# EAGLE design XPDR_Board_2 (EAGLE 7.2.0)
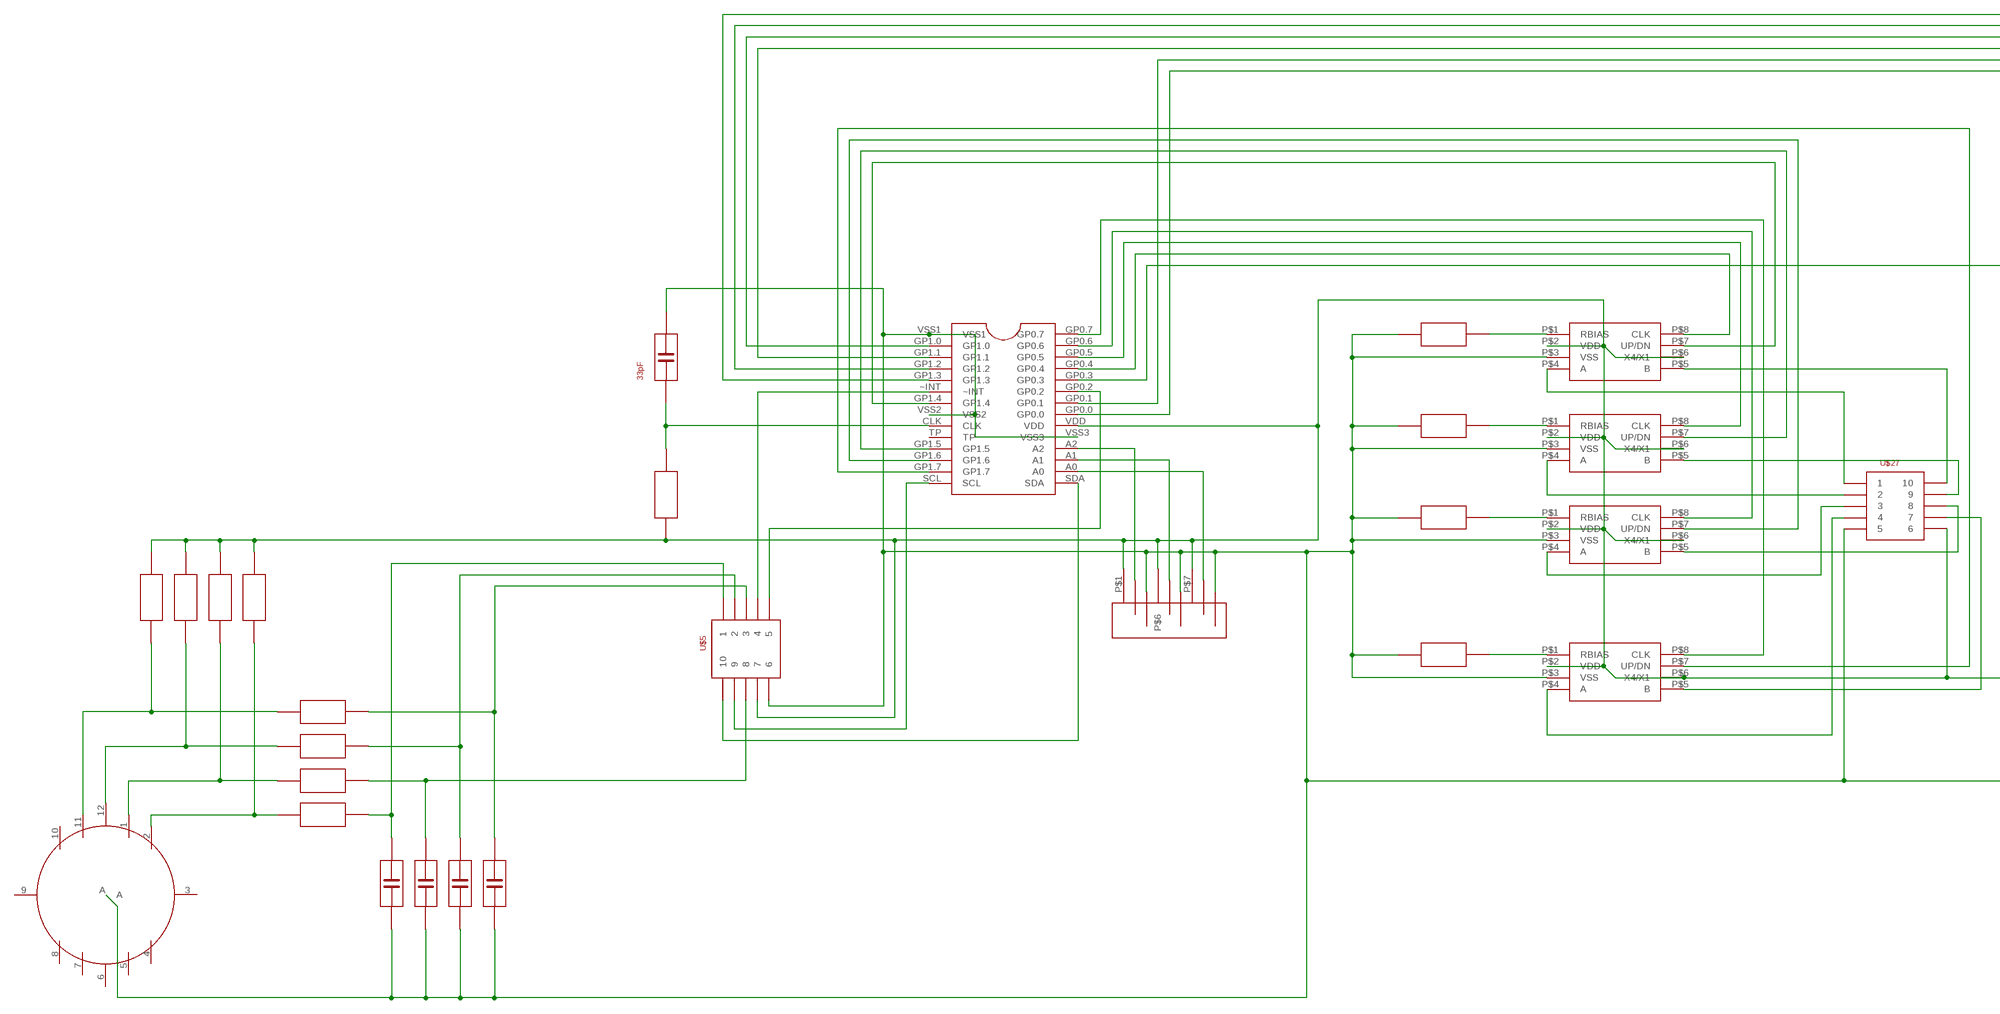
[diagram p0: schematic, sheet 1, part 1 of 2]
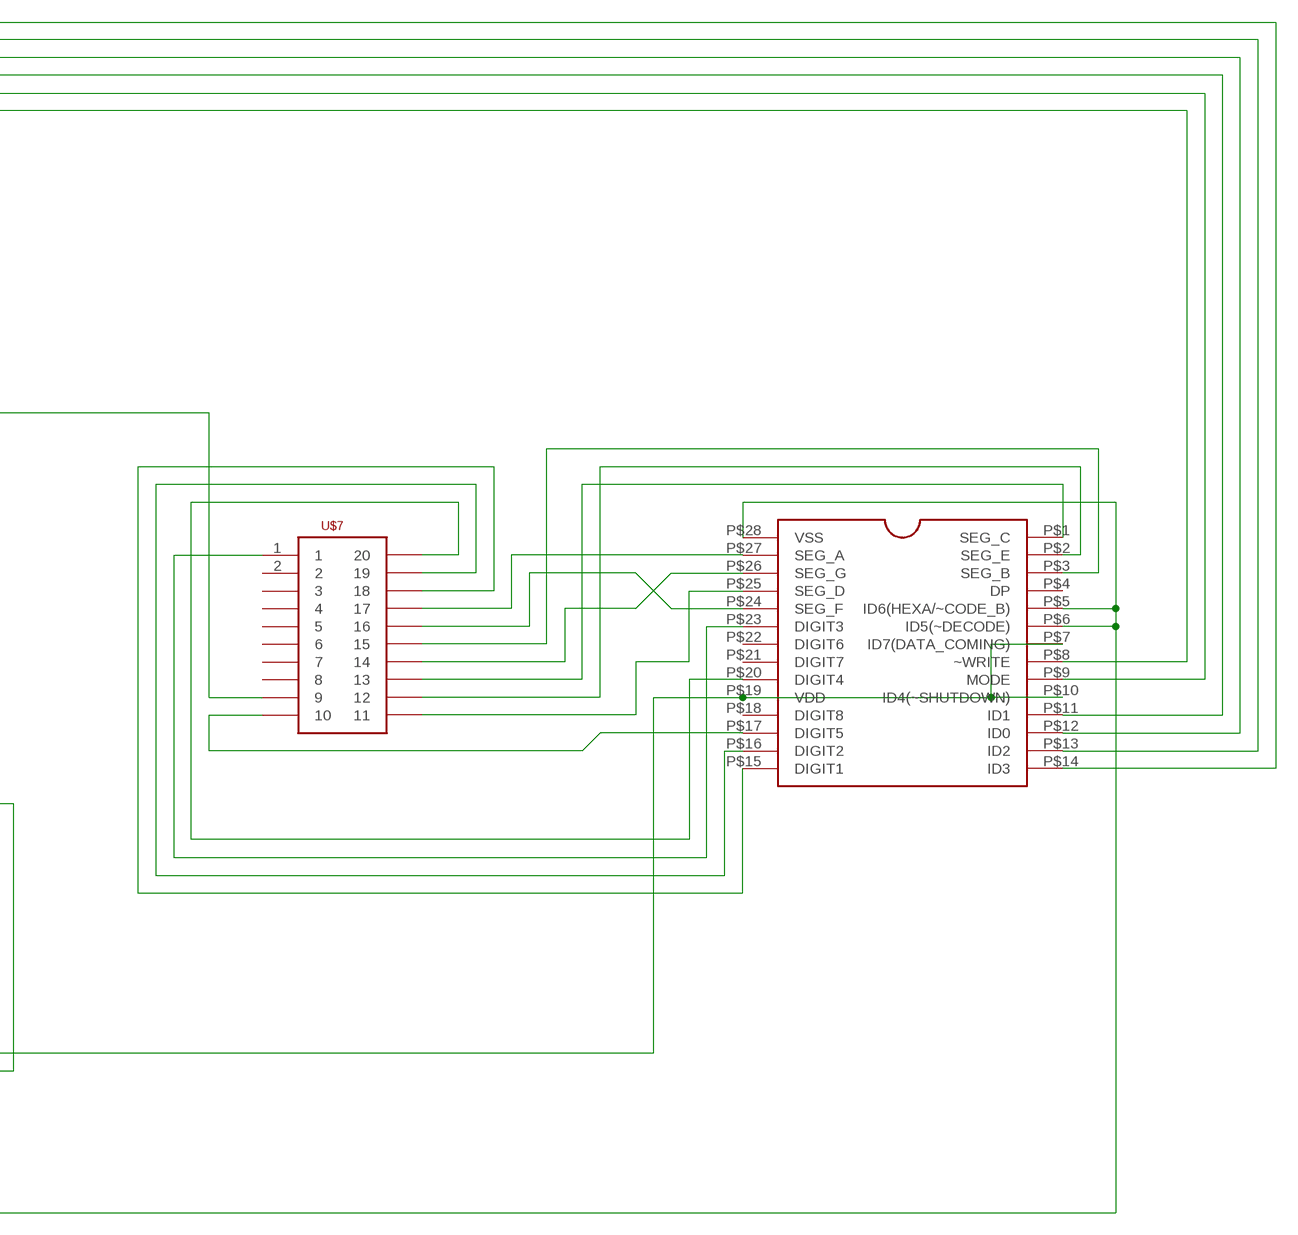
[diagram p1: schematic, sheet 1, part 2 of 2]

## Parts
U$1  LS7084  [LS7084]
U$2  LS7084  [LS7084]
U$3  LS7084  [LS7084]
U$4  LS7084  [LS7084]
U$5  LISTA_2X5  [LISTA_2X5]
U$6  ICM7228A  [ICM7228A]
U$7  LISTA_2X10  [LISTA_2X10]
U$8  470M  REZISTOR  [REZISTOR]
U$9  MCP23016  [MCP23016]
U$10  470M  REZISTOR  [REZISTOR]
U$11  ADRESA_0..2  [ADRESA_0..2]
U$12  470M  REZISTOR  [REZISTOR]
U$13  470M  REZISTOR  [REZISTOR]
U$14  3.9k  REZISTOR  [REZISTOR]
U$15  33pF  KONDENZATOR  [KONDENZATOR]
U$16  ROTARY_SWITCH  [ROTARY_SWITCH]
U$17  REZISTOR  [REZISTOR]
U$18  REZISTOR  [REZISTOR]
U$19  REZISTOR  [REZISTOR]
U$20  REZISTOR  [REZISTOR]
U$21  REZISTOR  [REZISTOR]
U$22  REZISTOR  [REZISTOR]
U$23  REZISTOR  [REZISTOR]
U$24  REZISTOR  [REZISTOR]
U$25  KONDENZATOR  [KONDENZATOR]
U$26  KONDENZATOR  [KONDENZATOR]
U$27  LISTA_2X5  [LISTA_2X5]
U$28  KONDENZATOR  [KONDENZATOR]
U$29  KONDENZATOR  [KONDENZATOR]

## Nets
GND: U$1.P$3(VSS) U$2.P$3(VSS) U$3.P$3(VSS) U$4.P$3(VSS) U$5.6 U$6.P$5(ID6(HEXA/~CODE_B)) U$6.P$6(ID5(~DECODE)) U$6.P$28(VSS) U$8.P$1 U$9.VSS1 U$9.VSS2 U$9.VSS3 U$10.P$1 U$11.P$3 U$11.P$4 U$11.P$9 U$12.P$1 U$13.P$1 U$15.P$2 U$16.A U$25.P$1 U$26.P$1 U$27.5 U$28.P$1 U$29.P$1
N$1: U$6.P$27(SEG_A) U$7.17
N$2: U$6.P$24(SEG_F) U$7.16
N$3: U$6.P$3(SEG_B) U$7.15
N$4: U$6.P$26(SEG_G) U$7.14
N$5: U$6.P$1(SEG_C) U$7.13
N$6: U$6.P$2(SEG_E) U$7.12
N$7: U$6.P$25(SEG_D) U$7.11
N$8: U$6.P$15(DIGIT1) U$7.18
N$9: U$6.P$16(DIGIT2) U$7.19
N$10: U$6.P$23(DIGIT3) U$7.1
N$11: U$6.P$20(DIGIT4) U$7.20
N$12: U$1.P$2(VDD) U$1.P$6(X4/X1) U$2.P$2(VDD) U$2.P$6(X4/X1) U$3.P$2(VDD) U$3.P$6(X4/X1) U$4.P$2(VDD) U$4.P$6(X4/X1) U$5.7 U$6.P$7(ID7(DATA_COMING)) U$6.P$10(ID4(~SHUTDOWN)) U$6.P$19(VDD) U$9.VDD U$11.P$1 U$11.P$6 U$11.P$7 U$14.P$1 U$17.P$1 U$18.P$1 U$19.P$1 U$20.P$1 U$27.6
N$13: U$6.P$12(ID0) U$9.GP1.0
N$14: U$1.P$8(CLK) U$9.GP0.4
N$15: U$2.P$8(CLK) U$9.GP0.5
N$16: U$1.P$1(RBIAS) U$8.P$2
N$17: U$2.P$1(RBIAS) U$10.P$2
N$18: U$3.P$1(RBIAS) U$12.P$2
N$19: U$4.P$1(RBIAS) U$13.P$2
N$20: U$6.P$11(ID1) U$9.GP1.1
N$21: U$3.P$8(CLK) U$9.GP0.6
N$22: U$4.P$8(CLK) U$9.GP0.7
N$23: U$1.P$7(UP/DN) U$9.GP1.4
N$24: U$1.P$4(A) U$27.1
N$25: U$1.P$5(B) U$27.10
N$26: U$2.P$4(A) U$27.2
N$27: U$2.P$5(B) U$27.9
N$28: U$3.P$4(A) U$27.3
N$29: U$3.P$5(B) U$27.8
N$30: U$4.P$4(A) U$27.4
N$31: U$4.P$5(B) U$27.7
N$32: U$2.P$7(UP/DN) U$9.GP1.5
N$33: U$3.P$7(UP/DN) U$9.GP1.6
N$34: U$4.P$7(UP/DN) U$9.GP1.7
N$35: U$9.A0 U$11.P$8
N$36: U$9.A1 U$11.P$5
N$37: U$9.A2 U$11.P$2
N$38: U$6.P$13(ID2) U$9.GP1.2
N$39: U$6.P$14(ID3) U$9.GP1.3
N$40: U$16.11 U$17.P$2 U$21.P$2
N$41: U$6.P$8(~WRITE) U$9.GP0.0
N$42: U$6.P$9(MODE) U$9.GP0.1
N$43: U$16.12 U$18.P$2 U$22.P$2
N$44: U$5.9 U$9.SCL
N$45: U$5.10 U$9.SDA
N$46: U$5.4 U$9.~INT
N$47: U$5.5 U$9.GP0.2
N$48: U$9.CLK U$14.P$2 U$15.P$1
N$49: U$7.9 U$9.GP0.3
N$50: U$6.P$17(DIGIT5) U$7.10
N$51: U$16.1 U$19.P$2 U$23.P$2
N$52: U$16.2 U$20.P$2 U$24.P$2
N$54: U$5.8 U$23.P$1 U$26.P$2
N$55: U$5.2 U$22.P$1 U$28.P$2
N$56: U$5.3 U$21.P$1 U$29.P$2
N$59: U$5.1 U$24.P$1 U$25.P$2
Unconnected: U$6.P$4(DP) U$6.P$18(DIGIT8) U$6.P$21(DIGIT7) U$6.P$22(DIGIT6) U$7.2 U$7.3 U$7.4 U$7.5 U$7.6 U$7.7 U$7.8 U$9.TP U$16.3 U$16.4 U$16.5 U$16.6 U$16.7 U$16.8 U$16.9 U$16.10

## Library data of the parts
U$1-U$4 = library:LS7084
U$5 U$27 = library:LISTA_2X5
U$6 = library:ICM7228A
U$7 = library:LISTA_2X10
U$8 U$10 U$12-U$14 U$17-U$24 = library:REZISTOR
U$9 = library:MCP23016
U$11 = library:ADRESA_0..2
U$15 U$25 U$26 U$28 U$29 = library:KONDENZATOR
U$16 = library:ROTARY_SWITCH

## Board
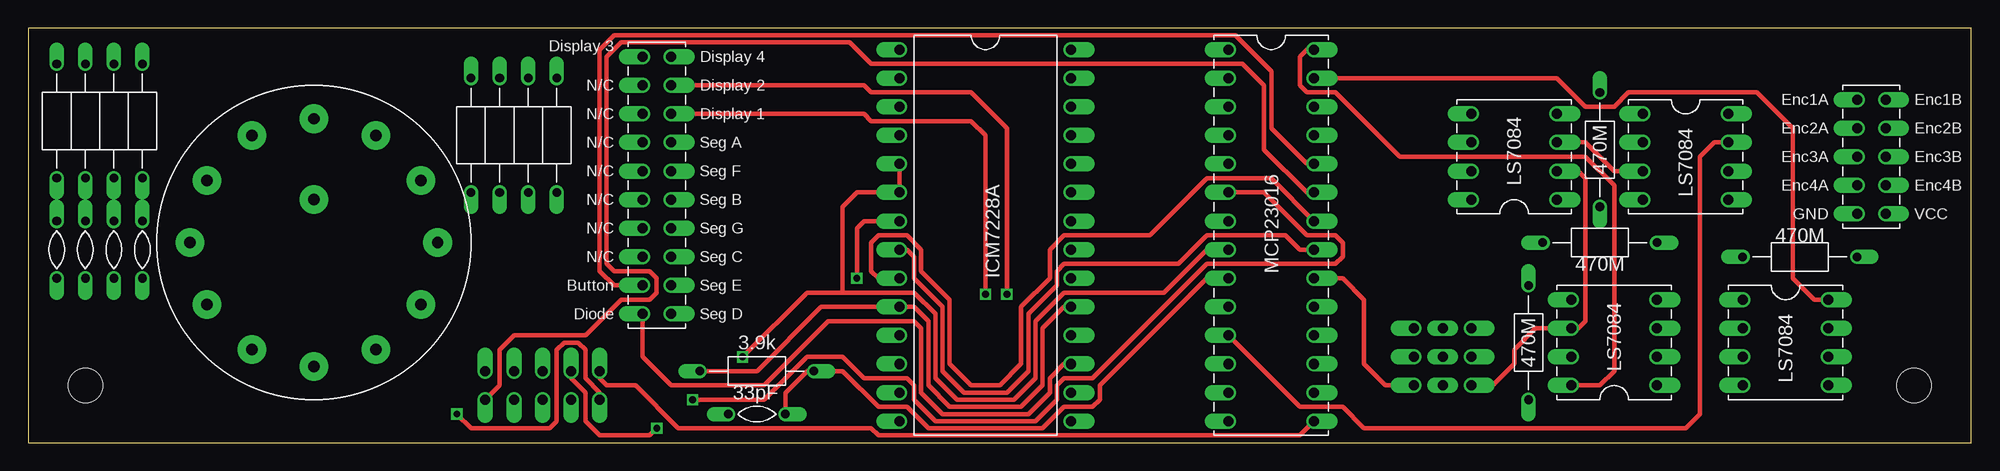
[diagram p2: board, top side]
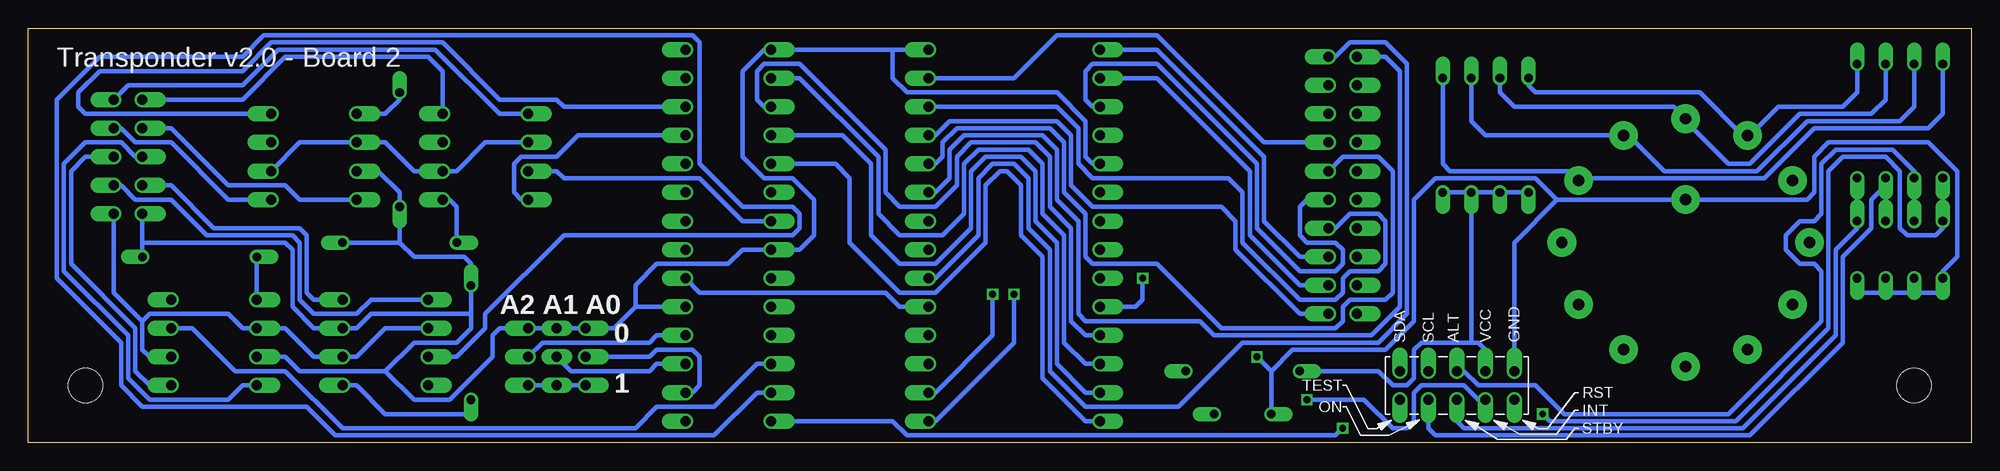
[diagram p3: board, bottom side, seen from below]

Size 172.72 x 36.83 mm. Coordinates in mm from the lower left corner, seen from the top.
Outline: 0,36.83 0,0 172.72,0 172.72,36.83 0,36.83
Copper layers (1*16): Top 0.035mm / dielectric 1.5mm / Bottom 0.035mm
Design rules "RadioStack_v2 *": minimum track width 0.2mm, minimum drill 0.4mm, track to track 0.2mm, track to pad 0.2mm, pad to pad 0.2mm, via to via 0.2mm, smd to smd 0.2mm, copper to edge 0.4mm, drill to drill 8mil, minimum pad ring 10mil, minimum via ring 8mil, stop-mask expansion 4mil, vias tented up to drill 0mil, thermal gap 10mil
Holes 3.05 mm at 167.64,5.08 5.08,5.08

### Footprints (pad centres in the part's own frame; a part is rotated, then mirrored left to right if it is on the bottom)
LS7084 = drill 0.889 pad 1.27 offset: P$1 0,0; P$2 0,-2.54; P$3 0,-5.08; P$4 0,-7.62; P$5 7.62,-7.62; P$6 7.62,-5.08; P$7 7.62,-2.54; P$8 7.62,0
LISTA_2X5 = drill 0.889 pad 1.27 offset: 1 0,0; 2 0,-2.54; 3 0,-5.08; 4 0,-7.62; 5 0,-10.16; 6 2.54,-10.16; 7 2.54,-7.62; 8 2.54,-5.08; 9 2.54,-2.54; 10 2.54,0
ICM7228A = drill 0.889 pad 1.27 offset: P$1 0,0; P$2 0,-2.54 | drill 0.889 offset: P$3 0,-5.08; P$4 0,-7.62; P$5 0,-10.16; P$6 0,-12.7; P$7 0,-15.24; P$8 0,-17.78; P$9 0,-20.32; P$10 0,-22.86; P$11 0,-25.4; P$12 0,-27.94; P$13 0,-30.48; P$14 0,-33.02; P$15 15.24,-33.02; P$16 15.24,-30.48; P$17 15.24,-27.94; P$18 15.24,-25.4; P$19 15.24,-22.86; P$20 15.24,-20.32; P$21 15.24,-17.78; P$22 15.24,-15.24; P$23 15.24,-12.7; P$24 15.24,-10.16; P$25 15.24,-7.62; P$26 15.24,-5.08; P$27 15.24,-2.54; P$28 15.24,0
LISTA_2X10 = drill 0.889 pad 1.27 offset: 1 0,0; 2 0,-2.54; 3 0,-5.08; 4 0,-7.62; 5 0,-10.16; 6 0,-12.7; 7 0,-15.24; 8 0,-17.78; 9 0,-20.32; 10 0,-22.86; 11 2.54,-22.86; 12 2.54,-20.32; 13 2.54,-17.78; 14 2.54,-15.24; 15 2.54,-12.7; 16 2.54,-10.16; 17 2.54,-7.62; 18 2.54,-5.08; 19 2.54,-2.54; 20 2.54,0
REZISTOR = drill 0.762 pad 1.27 offset: P$1 -5.08,0; P$2 5.08,0
MCP23016 = drill 0.889 pad 1.27 offset: A0 7.62,-30.48; A1 7.62,-27.94; A2 7.62,-25.4; CLK 0,-20.32; GP0.0 7.62,-17.78; GP0.1 7.62,-15.24; GP0.2 7.62,-12.7; GP0.3 7.62,-10.16; GP0.4 7.62,-7.62; GP0.5 7.62,-5.08; GP0.6 7.62,-2.54; GP0.7 7.62,0; GP1.0 0,-2.54; GP1.1 0,-5.08; GP1.2 0,-7.62; GP1.3 0,-10.16; GP1.4 0,-15.24; GP1.5 0,-25.4; GP1.6 0,-27.94; GP1.7 0,-30.48; SCL 0,-33.02; SDA 7.62,-33.02; TP 0,-22.86; VDD 7.62,-20.32; VSS1 0,0; VSS2 0,-17.78; VSS3 7.62,-22.86; ~INT 0,-12.7
ADRESA_0..2 = drill 0.889 pad 1.27 offset: P$1 0,0; P$2 0,-2.54; P$3 0,-5.08; P$7 5.08,0; P$8 5.08,-2.54; P$9 5.08,-5.08 | drill 0.889 pad 1.27 long: P$4 2.54,-5.08; P$5 2.54,-2.54; P$6 2.54,0
KONDENZATOR = drill 0.762 pad 1.27 offset: P$1 -2.54,0; P$2 2.54,0
ROTARY_SWITCH = drill 1.016 pad 2.54: 1 5.5,9.5; 2 9.5,5.5; 3 11,0; 4 9.5,-5.5; 5 5.5,-9.5; 6 0,-11; 7 -5.5,-9.5; 8 -9.5,-5.5; 9 -11,0; 10 -9.5,5.5; 11 -5.5,9.5; 12 0,11; A 0,3.81

### Placement (x,y rotation side)
U$1  135.89,21.59 180 top
U$2  143.51,29.21 0 top
U$3  152.4,12.7 0 top
U$4  144.78,5.08 180 top
U$5  50.8,3.81 90 bottom
U$6  77.47,34.92 0 top
U$7  54.61,34.29 0 top
U$8  139.7,17.78 180 top
U$9  106.68,34.92 0 top
U$10  139.7,26.03 90 top
U$11  128.27,5.08 180 top
U$12  157.48,16.51 180 top
U$13  133.35,8.89 270 top
U$14  64.77,6.35 0 top
U$15  64.77,2.54 180 top
U$16  25.4,17.78 0 top
U$17  39.37,27.3 90 top
U$18  41.91,27.3 90 top
U$19  44.45,27.3 90 top
U$20  46.99,27.3 90 top
U$21  10.16,28.57 90 top
U$22  7.62,28.57 90 top
U$23  5.08,28.57 90 top
U$24  2.54,28.57 90 top
U$25  2.54,17.14 90 top
U$26  5.08,17.14 90 top
U$27  162.56,30.48 0 top
U$28  7.62,17.14 90 top
U$29  10.16,17.14 90 top

### Tracks (layer width: path | path; a pad name or v marks a point on that pad's centre or on a via)
GND  (via drill 0.6)
  Top 0.406: U$1.P$3 138.43,26.67 140.97,24.13 U$2.P$3 | U$6.P$5 U$6.P$6 73.66,22.22 72.39,20.95 72.39,13.33 | 72.39,13.33 78.74,13.33 80.64,11.43 80.64,5.71 82.55,3.81 87.63,3.81 89.53,5.71 89.53,10.79 92.08,13.33 100.97,13.33 104.78,17.14 U$9.VSS2 | v63.5,7.62 69.22,13.33 72.39,13.33
  Bottom 0.406: 5.08,13.33 2.54,13.33 U$25.P$1 2.54,15.24 1.27,16.51 1.27,24.13 3.81,26.67 12.7,26.67 13.97,25.4 13.97,22.22 14.61,21.59 U$16.A 36.83,21.59 | U$26.P$1 5.08,13.33 | 5.08,13.33 7.62,13.33 | U$28.P$1 7.62,13.33 | 7.62,13.33 10.16,13.33 U$29.P$1 | U$6.P$5 78.11,24.77 78.74,25.4 78.74,28.57 81.28,31.11 94.61,31.11 95.89,32.38 95.89,34.92 | 162.56,17.78 U$27.5 | 133.35,11.43 142.24,11.43 143.51,10.16 U$4.P$3 147.32,10.16 149.22,12.06 149.22,17.14 149.86,17.78 162.56,17.78 | U$12.P$1 162.56,17.78 | U$3.P$3 149.86,7.62 148.59,6.35 140.97,6.35 | 140.97,6.35 138.43,8.89 134.62,8.89 133.35,10.16 133.35,11.43 | U$2.P$3 141.6,24.13 139.7,22.22 U$10.P$1 139.7,17.78 | U$8.P$1 139.7,17.78 | 140.97,6.35 138.43,3.81 135.25,3.81 131.44,7.62 131.44,9.52 130.81,10.16 U$11.P$3 U$11.P$4 U$11.P$9 120.65,10.16 118.75,12.06 | 118.75,12.06 U$9.VSS3 | 139.7,17.78 138.43,16.51 133.99,16.51 133.35,15.88 U$13.P$1 133.35,11.43 | U$6.P$28 95.89,34.92 | 95.89,34.92 U$9.VSS1 107.31,34.92 109.22,33.02 109.22,25.4 107.31,23.49 104.78,23.49 102.87,21.59 102.87,18.41 104.14,17.14 U$9.VSS2 109.22,17.14 110.49,15.88 116.84,15.88 118.75,13.97 118.75,12.06 | v63.5,7.62 62.23,6.35 | 62.23,6.35 U$15.P$2 | U$5.6 40.64,17.78 36.83,21.59 | 36.83,21.59 38.73,23.49 47.62,23.49 49.53,21.59 49.53,10.79 52.07,8.25 60.33,8.25 62.23,6.35
N$1
  Bottom 0.406: U$6.P$27 85.09,32.38 81.28,36.2 72.39,36.2 62.87,26.67 U$7.17
N$2
  Bottom 0.406: U$6.P$24 92.08,24.77 91.44,25.4 91.44,26.67 90.17,27.94 81.92,27.94 80.64,26.67 80.64,22.22 78.74,20.32 78.74,16.51 78.11,15.88 72.39,15.88 66.67,10.16 56.52,10.16 55.88,10.79 55.88,12.06 55.24,12.7 52.07,12.7 51.44,13.33 51.44,24.13 52.7,25.4 55.88,25.4 U$7.16
N$3
  Bottom 0.406: U$7.15 59.05,21.59 59.69,20.95 59.69,18.41 59.05,17.78 56.52,17.78 55.88,17.14 55.88,15.88 56.52,15.24 59.69,15.24 63.5,19.05 63.5,24.77 72.39,33.66 78.11,33.66 78.74,33.02 78.74,30.48 78.11,29.84 U$6.P$3
N$4
  Bottom 0.406: U$7.14 56.52,19.05 55.24,20.32 52.7,20.32 52.07,19.68 52.07,15.88 52.7,15.24 55.24,15.24 55.88,14.6 55.88,13.33 56.52,12.7 59.69,12.7 64.77,17.78 64.77,22.22 66.04,23.49 78.11,23.49 79.38,24.77 79.38,27.94 81.28,29.84 U$6.P$26
N$5
  Bottom 0.406: U$6.P$1 72.39,34.92 62.87,25.4 62.87,19.68 59.69,16.51 U$7.13
N$6
  Bottom 0.406: U$6.P$2 72.39,32.38 64.14,24.13 64.14,18.41 59.69,13.97 U$7.12
N$7
  Bottom 0.406: U$7.11 59.69,11.43 65.41,17.14 65.41,19.68 66.67,20.95 78.11,20.95 80.01,22.86 80.01,27.3 81.28,28.57 90.81,28.57 92.08,27.3 U$6.P$25
N$8  (via drill 0.6)
  Top 0.406: U$7.18 74.3,29.21 74.93,28.57 83.82,28.57 85.09,27.3 v85.09,13.18
  Bottom 0.406: v85.09,13.18 85.09,8.89 92.08,1.91 U$6.P$15
N$9  (via drill 0.6)
  Top 0.406: U$7.19 74.3,31.75 74.93,31.11 83.82,31.11 87,27.94 v87,13.18
  Bottom 0.406: v87,13.18 87,9.52 92.08,4.45 U$6.P$16
N$10
  Bottom 0.406: U$7.1 52.07,34.29 50.8,33.02 50.8,12.06 53.34,9.52 67.31,9.52 68.58,10.79 78.74,10.79 79.38,11.43 79.38,19.68 81.28,21.59 81.28,26.03 82.55,27.3 89.53,27.3 90.81,26.03 90.81,23.49 92.08,22.22 U$6.P$23
N$11
  Bottom 0.406: U$6.P$20 92.08,14.6 88.27,18.41 88.27,23.49 87,24.77 85.09,24.77 83.82,23.49 83.82,19.05 81.92,17.14 81.92,6.35 78.74,3.17 70.48,3.17 64.77,8.89 52.7,8.89 50.16,11.43 50.16,33.66 52.07,35.56 55.24,35.56 56.52,34.29 U$7.20
N$12  (via drill 0.6)
  Top 0.406: U$14.P$1 64.77,6.35 70.48,12.06 U$6.P$10 78.74,12.06 80.01,10.79 80.01,5.08 81.92,3.17 88.27,3.17 90.17,5.08 90.17,10.16 92.08,12.06 U$6.P$19 | U$1.P$2 137.79,24.13 138.43,23.49 138.43,10.79 137.79,10.16 U$4.P$6 133.99,10.16 132.08,8.25 132.08,6.98 130.18,5.08 U$11.P$1 | U$9.VDD 116.84,14.6 118.75,12.7 118.75,6.98 120.65,5.08 U$11.P$7 | U$6.P$7 74.3,19.68 73.66,19.05 v73.66,14.6
  Bottom 0.406: U$4.P$6 140.97,10.16 143.51,7.62 U$4.P$2 147.32,7.62 149.86,10.16 U$3.P$2 153.67,10.16 154.94,11.43 161.93,11.43 162.56,10.79 | U$3.P$6 161.93,7.62 162.56,8.25 162.56,10.79 | U$27.6 165.1,13.33 162.56,10.79 | U$11.P$7 U$11.P$6 U$11.P$1 | U$1.P$6 132.08,26.67 134.62,24.13 U$1.P$2 138.43,24.13 140.97,26.67 U$2.P$2 148.59,26.67 U$2.P$6 | U$6.P$19 95.25,12.06 96.52,13.33 113.03,13.33 U$9.VDD | v73.66,14.6 73.66,12.7 74.3,12.06 U$6.P$10 | U$14.P$1 52.7,6.35 51.44,5.08 50.16,5.08 49.53,5.71 49.53,8.25 48.9,8.89 44.45,8.89 | U$17.P$1 U$18.P$1 U$19.P$1 | U$19.P$1 U$20.P$1 | U$19.P$1 44.45,8.89 | 44.45,8.89 43.81,8.89 43.18,8.25 U$5.7
N$13
  Bottom 0.406: U$6.P$12 78.74,6.98 80.64,8.89 80.64,18.41 82.55,20.32 82.55,24.77 83.82,26.03 88.27,26.03 89.53,24.77 89.53,20.32 91.44,18.41 95.25,18.41 97.16,20.32 97.16,25.4 104.14,32.38 U$9.GP1.0
N$14
  Bottom 0.406: U$1.P$8 128.91,21.59 129.54,22.22 129.54,24.77 128.91,25.4 125.73,25.4 123.83,27.3 U$9.GP0.4
N$15
  Bottom 0.406: U$9.GP0.5 125.09,29.84 125.73,30.48 130.81,30.48 135.89,35.56 151.13,35.56 153.67,33.02 166.37,33.02 168.28,31.11 168.28,29.84 167.64,29.21 U$2.P$8
N$16
  Bottom 0.406: U$8.P$2 134.62,20.95 135.25,21.59 U$1.P$1
N$17
  Bottom 0.406: U$2.P$1 140.97,29.21 139.7,30.48 U$10.P$2
N$18
  Bottom 0.406: U$3.P$1 U$12.P$2
N$19
  Bottom 0.406: U$13.P$2 133.35,2.54 140.97,2.54 143.51,5.08 U$4.P$1
N$20
  Bottom 0.406: U$6.P$11 78.74,9.52 80.01,10.79 80.01,19.05 81.92,20.95 81.92,25.4 83.19,26.67 88.9,26.67 90.17,25.4 90.17,22.86 92.08,20.95 95.25,20.95 96.52,22.22 96.52,26.03 104.14,33.66 107.31,33.66 107.95,33.02 107.95,30.48 107.31,29.84 U$9.GP1.1
N$21
  Top 0.406: U$9.GP0.6 135.89,32.38 138.43,29.84 140.97,29.84 142.24,31.11 153.67,31.11 156.84,27.94 156.84,14.6 158.75,12.7 U$3.P$8
N$22
  Top 0.406: U$9.GP0.7 113.67,34.92 113.03,34.29 113.03,31.75 113.67,31.11 116.2,31.11 121.92,25.4 138.43,25.4 140.97,22.86 140.97,6.35 139.7,5.08 U$4.P$8
N$23
  Bottom 0.406: U$9.GP1.4 109.22,19.68 113.03,23.49 125.09,23.49 125.73,24.13 U$1.P$7
N$24
  Bottom 0.406: U$27.1 153.67,30.48 149.86,34.29 137.16,34.29 135.89,33.02 U$1.P$4
N$25
  Bottom 0.406: U$27.10 163.83,31.75 153.67,31.75 150.5,34.92 136.53,34.92 130.81,29.21 U$1.P$5
N$26
  Bottom 0.406: U$2.P$4 148.59,21.59 149.86,22.86 154.94,22.86 160.02,27.94 U$27.2
N$27
  Bottom 0.406: U$2.P$5 154.94,21.59 160.02,26.67 163.19,26.67 164.47,27.94 U$27.9
N$28
  Bottom 0.406: U$27.3 163.19,25.4 164.47,26.67 167.64,26.67 169.54,24.77 169.54,15.24 163.83,9.52 163.83,5.71 161.93,3.81 154.94,3.81 153.67,5.08 U$3.P$4
N$29
  Bottom 0.406: U$3.P$5 161.93,5.08 163.19,6.35 163.19,10.16 168.91,15.88 168.91,24.13 167.64,25.4 U$27.8
N$30
  Bottom 0.406: U$4.P$4 147.32,12.7 147.96,13.33 147.96,18.41 148.59,19.05 156.21,19.05 160.02,22.86 U$27.4
N$31
  Bottom 0.406: U$4.P$5 142.24,12.7 143.51,11.43 147.32,11.43 148.59,12.7 148.59,17.78 149.22,18.41 156.84,18.41 160.02,21.59 163.19,21.59 164.47,22.86 U$27.7
N$32
  Top 0.406: U$9.GP1.5 113.03,3.17 116.84,3.17 118.75,1.27 147.32,1.27 148.59,2.54 148.59,25.4 149.86,26.67 U$2.P$7
N$33
  Bottom 0.406: U$3.P$7 158.12,10.16 154.31,6.35 149.86,6.35 144.78,1.27 118.75,1.27 116.84,3.17 111.76,3.17 107.95,6.98 U$9.GP1.6
N$34
  Bottom 0.406: U$9.GP1.7 107.95,4.45 111.76,0.63 145.41,0.63 147.96,3.17 162.56,3.17 164.47,5.08 164.47,8.89 170.18,14.6 170.18,30.48 166.37,34.29 153.67,34.29 151.76,36.2 113.67,36.2 113.03,35.56 113.03,24.77 109.22,20.95 104.78,20.95 104.14,20.32 104.14,19.05 104.78,18.41 125.09,18.41 132.08,11.43 132.08,10.16 134.62,7.62 U$4.P$7
N$35
  Bottom 0.406: U$11.P$8 117.47,7.62 116.84,8.25 113.67,8.25 113.03,7.62 113.03,5.08 113.67,4.45 U$9.A0
N$36
  Bottom 0.406: U$11.P$5 124.46,6.35 117.47,6.35 116.84,6.98 U$9.A1
N$37
  Bottom 0.406: U$9.A2 116.84,9.52 117.47,8.89 127,8.89 U$11.P$2
N$38
  Bottom 0.406: U$9.GP1.2 100.33,27.3 97.79,24.77 97.79,18.41 95.25,15.88 92.08,15.88 88.9,19.05 88.9,24.13 87.63,25.4 84.45,25.4 83.19,24.13 83.19,19.68 81.28,17.78 81.28,6.98 78.74,4.45 U$6.P$13
N$39
  Bottom 0.406: U$6.P$14 78.74,1.91 82.55,5.71 82.55,16.51 84.45,18.41 84.45,22.86 85.72,24.13 86.36,24.13 87.63,22.86 87.63,17.78 92.08,13.33 95.25,13.33 99.69,17.78 99.69,23.49 100.97,24.77 U$9.GP1.3
N$40
  Bottom 0.406: U$17.P$2 39.37,31.75 38.73,31.11 24.13,31.11 20.3,27.28 U$16.11 19.71,27.28 19.68,27.3 17.14,29.84 11.43,29.84 10.16,31.11 U$21.P$2
N$41
  Top 0.406: U$9.GP0.0 113.03,17.14 111.76,18.41 104.78,18.41 102.23,15.88 92.08,15.88 91.44,15.24 91.44,13.97 88.9,11.43 88.9,6.35 87,4.45 83.19,4.45 81.28,6.35 81.28,12.06 78.74,14.6 78.74,16.51 78.11,17.14 U$6.P$8
N$42
  Top 0.406: U$9.GP0.1 110.49,23.49 104.78,23.49 99.69,18.41 92.08,18.41 90.81,17.14 90.81,14.6 88.27,12.06 88.27,6.98 86.36,5.08 83.82,5.08 81.92,6.98 81.92,12.7 79.38,15.24 79.38,17.14 78.11,18.41 75.56,18.41 74.93,17.78 74.93,15.24 75.56,14.6 U$6.P$9
N$43
  Bottom 0.406: U$18.P$2 41.91,31.11 40.64,29.84 26.46,29.84 U$16.12 25.4,28.57 21.59,24.77 19.68,24.77 15.24,29.21 8.89,29.21 7.62,30.48 U$22.P$2
N$44  (via drill 0.6)
  Top 0.406: v55.88,1.27 55.24,0.63 50.8,0.63 49.53,1.91 49.53,4.45 48.26,5.71 U$5.9
  Bottom 0.406: U$9.SCL 95.89,1.91 94.61,0.63 56.52,0.63 v55.88,1.27
N$45
  Top 0.406: U$9.SDA 113.03,0.63 75.56,0.63 74.93,1.27 57.78,1.27 53.98,5.08 51.44,5.08 50.8,5.71 U$5.10
N$46  (via drill 0.6)
  Top 0.406: v59.05,3.81 65.41,3.81 69.22,7.62 72.39,7.62 74.3,5.71 78.11,5.71 78.74,5.08 78.74,3.81 80.64,1.91 89.53,1.91 91.44,3.81 91.44,5.08 92.08,5.71 94.61,5.71 104.78,15.88 116.2,15.88 116.84,16.51 116.84,17.78 116.2,18.41 113.67,18.41 109.86,22.22 U$9.~INT
  Bottom 0.406: v59.05,3.81 53.98,3.81 51.44,1.27 50.16,1.27 49.53,1.91 49.53,4.45 48.9,5.08 45.09,5.08 43.81,3.81 U$5.4
N$47
  Top 0.406: U$9.GP0.2 113.67,22.22 109.86,26.03 109.86,31.75 107.95,33.66 74.93,33.66 73.03,35.56 52.7,35.56 51.44,34.29 51.44,15.88 52.07,15.24 55.24,15.24 55.88,14.6 55.88,13.33 55.24,12.7 52.7,12.7 49.53,9.52 43.18,9.52 41.91,8.25 41.91,5.08 U$5.5
N$48
  Top 0.406: U$9.CLK 104.78,14.6 95.25,5.08 95.25,3.81 94.61,3.17 92.08,3.17 90.17,1.27 80.01,1.27 78.11,3.17 75.56,3.17 72.39,6.35 U$14.P$2 69.22,6.35 67.31,4.45 U$15.P$1
N$49
  Top 0.406: U$9.GP0.3 113.67,24.77 110.49,27.94 110.49,33.02 107.31,36.2 52.07,36.2 50.8,34.92 50.8,15.24 52.07,13.97 U$7.9
N$50
  Top 0.406: U$7.10 54.61,7.62 57.15,5.08 65.41,5.08 71.12,10.79 78.74,10.79 79.38,10.16 79.38,4.45 81.28,2.54 88.9,2.54 90.81,4.45 90.81,5.71 92.08,6.98 U$6.P$17
N$51
  Bottom 0.406: U$19.P$2 44.45,28.57 43.18,27.3 31.11,27.3 30.93,27.3 | U$23.P$2 5.08,29.84 6.35,28.57 14.61,28.57 19.05,24.13 27.3,24.13 30.48,27.3 30.93,27.3 | 30.93,27.3 U$16.1
N$52
  Bottom 0.406: U$20.P$2 46.99,24.77 46.35,24.13 35.56,24.13 34.92,23.49 34.9,23.47 U$16.2 34.69,23.49 18.41,23.49 13.97,27.94 3.81,27.94 2.54,29.21 U$24.P$2
N$54
  Bottom 0.406: U$26.P$2 U$23.P$1 5.08,24.13 6.99,26.03 12.06,26.03 13.34,24.77 13.34,20.32 13.97,19.68 15.24,19.68 16.51,18.41 16.51,17.14 15.24,15.88 13.97,15.88 13.34,15.24 13.34,10.79 21.59,2.54 36.2,2.54 38.73,5.08 43.81,5.08 45.09,6.35 U$5.8
N$55
  Bottom 0.406: U$28.P$2 7.62,22.86 | 7.62,22.86 8.89,21.59 8.89,19.05 11.43,16.51 11.43,8.89 19.68,0.63 47.62,0.63 48.26,1.27 U$5.2 | 7.62,22.86 U$22.P$1
N$56
  Bottom 0.406: U$21.P$1 U$29.P$2 10.16,19.05 12.06,17.14 12.06,9.52 20.32,1.27 45.09,1.27 45.72,1.91 U$5.3
N$57
  cutout Bottom (isolate 1.016): 0.64,36.2 172.09,36.2 172.09,0.63 0.64,0.63
N$58
  cutout Top (isolate 1.016): 0.64,36.2 172.09,36.2 172.09,0.63 0.64,0.63
N$59  (via drill 0.6)
  Top 0.406: v38.1,2.54 39.37,1.27 46.35,1.27 46.99,1.91 46.99,8.25 47.62,8.89 48.9,8.89 49.53,8.25 49.53,5.71 50.8,4.45 U$5.1
  Bottom 0.406: U$24.P$1 U$25.P$2 2.54,19.05 3.17,18.41 5.71,18.41 6.35,19.05 6.35,24.13 7.62,25.4 11.43,25.4 12.7,24.13 12.7,10.16 20.95,1.91 37.47,1.91 v38.1,2.54

### Text on the board
tPlace: Display 3 | Display 4 | N/C | Display 2 | Enc1A | Enc1B | N/C | Display 1 | Enc2A | Enc2B | N/C | Seg A | Enc3A | Enc3B | N/C | Seg F | Enc4A | Enc4B | N/C | Seg B | GND | VCC | N/C | Seg G | N/C | Seg C | Button | Seg E | Diode | Seg D
bPlace: Transponder v2.0 - Board 2 | A0 | A1 | A2 | GND | VCC | ALT | SCL | SDA | 0 | RST | TEST | 1 | INT | ON | STBY